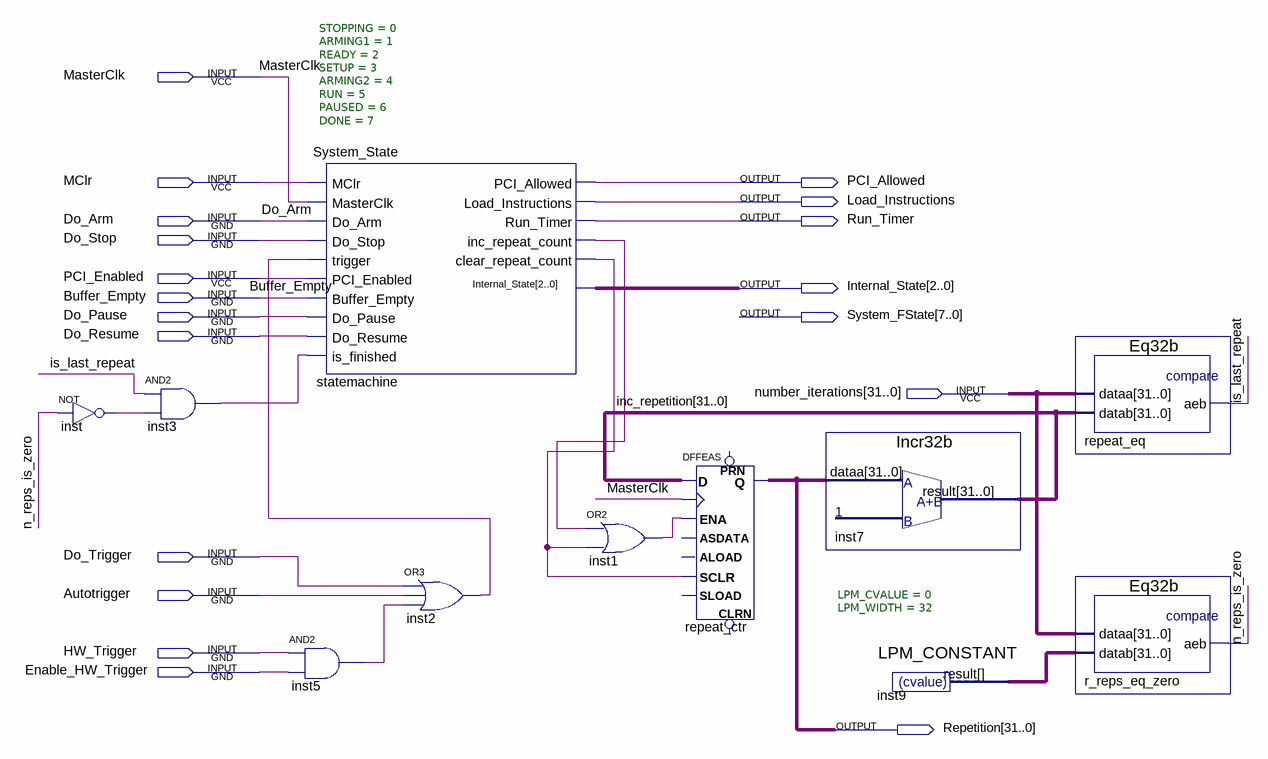
[diagram p0: schematic sheet]
// Quartus schematic SystemController.bdf as structural Verilog: 11 symbols, 19 pins
module SystemController (
  input  MasterClk,
  input  MClr,
  input  Do_Arm,
  input  Do_Stop,
  input  PCI_Enabled,
  input  Buffer_Empty,
  input  Do_Pause,
  input  Do_Resume,
  input  [31:0] number_iterations,
  input  Do_Trigger,
  input  Autotrigger,
  input  HW_Trigger,
  input  Enable_HW_Trigger,
  output PCI_Allowed,
  output Load_Instructions,
  output Run_Timer,
  output [2:0] Internal_State,
  output [7:0] System_FState,
  output [31:0] Repetition
);

  wire inst1_out, inst2_out, inst3_out, inst5_out, inst_out, is_last_repeat, n_reps_is_zero,
       statemachine_clear_repeat_count, statemachine_inc_repeat_count;
  wire [31:0] inc_repetition, inst9_result;

  not inst (inst_out, n_reps_is_zero);
  and inst3 (inst3_out, is_last_repeat, inst_out);
  and inst5 (inst5_out, HW_Trigger, Enable_HW_Trigger);
  System_State #(.STOPPING(0), .ARMING1(1), .READY(2), .SETUP(3), .ARMING2(4), .RUN(5), .PAUSED(6), .DONE(7)) statemachine (
    .MClr(MClr), .MasterClk(MasterClk), .Do_Arm(Do_Arm), .Do_Stop(Do_Stop), .trigger(inst2_out),
    .PCI_Enabled(PCI_Enabled), .Buffer_Empty(Buffer_Empty), .Do_Pause(Do_Pause), .Do_Resume(Do_Resume),
    .is_finished(inst3_out), .PCI_Allowed(PCI_Allowed), .Load_Instructions(Load_Instructions),
    .Run_Timer(Run_Timer), .inc_repeat_count(statemachine_inc_repeat_count),
    .clear_repeat_count(statemachine_clear_repeat_count), .Internal_State(Internal_State));
  or inst2 (inst2_out, Do_Trigger, Autotrigger, inst5_out);
  or inst1 (inst1_out, statemachine_inc_repeat_count, statemachine_clear_repeat_count);
  DFFEAS repeat_ctr[31:0] (
    .ENA(inst1_out), .CLK(MasterClk), .D(inc_repetition), .SCLR(statemachine_clear_repeat_count),
    .Q(Repetition));  // open: PRN, ALOAD, ASDATA, CLRN, SLOAD
  Incr32b inst7 (.dataa(Repetition), .result(inc_repetition));
  LPM_CONSTANT #(.LPM_CVALUE(0), .LPM_WIDTH(32)) inst9 (.result(inst9_result));
  Eq32b repeat_eq (.dataa(number_iterations), .datab(inc_repetition), .aeb(is_last_repeat));
  Eq32b r_reps_eq_zero (.dataa(number_iterations), .datab(inst9_result), .aeb(n_reps_is_zero));
endmodule
